# Altium project Geiger.PrjPcb
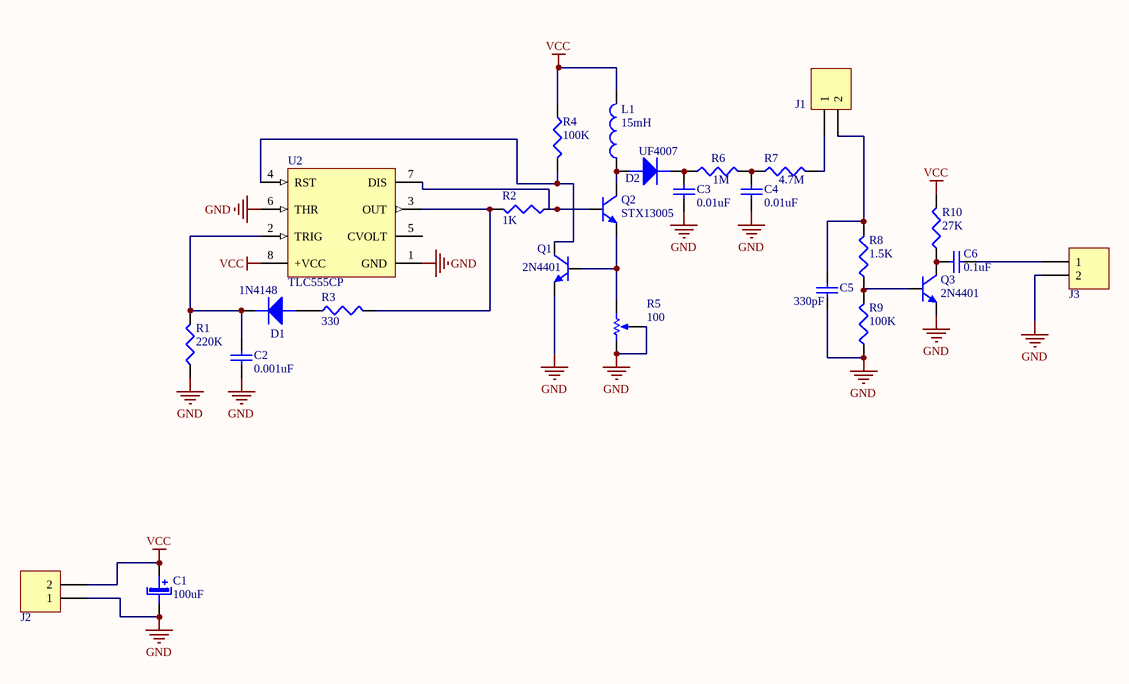
[diagram p0: Geiger.SchDoc]
1 sheet, 26 parts. Net scope: global (net labels, ports and power ports of the same name join across sheets).
Board file: Geiger.PcbDoc

## Sheet Geiger.SchDoc: Compteur Geiger
size A4; Author: Manoel da Silva; DrawnBy: Manoel da Silva; Engineer: Manoel da Silva

### Parts
C1  value 100uF  [CAPPR2-5x6.8]  (hidden comment: Cond pol axial)
C2  value 0.001uF  [CAPR2.54-5.1x3.2]  (hidden comment: Condensateur)
C3  value 0.01uF  [CAPPR5-5x5]  (hidden comment: Condensateur)
C4  value 0.01uF  [CAPPR5-5x5]  (hidden comment: Condensateur)
C5  value 330pF  [CAPR2.54-5.1x3.2]  (hidden comment: Condensateur)
C6  value 0.1uF  [CAPR2.54-5.1x3.2]  (hidden comment: Condensateur)
D1  value 1N4148  [AXIAL-0.3]  (hidden comment: Diode)
D2  Type: UF4007  [DIODE-0.4]  (hidden comment: Diode)
J1  Connecteur 2  [HDR1X2]  (value not drawn)
J2  Connecteur 2  [HDR1X2]  (value not drawn)
J3  Connecteur 2  [HDR1X2]  (value not drawn)
L1  value 15mH  [CAPPR7.5-16x35]  (hidden comment: Inductance)
Q1  value 2N4401  [TO-92]  (hidden comment: NPN)
Q2  value STX13005  [TO-92 - Bis]  (hidden comment: NPN)
Q3  value 2N4401  [TO-92]  (hidden comment: NPN)
R1  value 220K  [AXIAL-0.4]  (hidden comment: Résistance)
R2  value 1K  [AXIAL-0.4]  (hidden comment: Résistance)
R3  value 330  [AXIAL-0.4]  (hidden comment: Résistance)
R4  value 100K  [AXIAL-0.4]  (hidden comment: Résistance)
R5  Set Position: 100  [VR5]  (hidden comment: Potentiomètre)
R6  value 1M  [AXIAL-0.4]  (hidden comment: Résistance)
R7  value 4.7M  [AXIAL-0.4]  (hidden comment: Résistance)
R8  value 1.5K  [AXIAL-0.4]  (hidden comment: Résistance)
R9  value 100K  [AXIAL-0.4]  (hidden comment: Résistance)
R10  value 27K  [AXIAL-0.4]  (hidden comment: Résistance)
U2  TLC555CP  [DIP8]

### Nets
GND: C1.2(-) C2.1 C3.2 C4.2 C5.2 J2.1 J3.2 Q1.1(E) Q3.1(E) R1.1 R5.1(TOP) R5.3(TAP) R9.1 U2.1(GND) U2.6(THR)
VCC: C1.1(+) J2.2 L1.2 R4.1 R10.2 U2.8(+VCC)
NetC2_2: C2.2 D1.2(K) R1.2 U2.2(TRIG)
NetC3_1: C3.1 D2.2(K) R6.1
NetC4_1: C4.1 R6.2 R7.1
NetC5_1: C5.1 J1.2 R8.2
NetC6_1: C6.1 Q3.3(C) R10.1
NetC6_2: C6.2 J3.1
NetD1_1: D1.1(A) R3.1
NetD2_1: D2.1(A) L1.1 Q2.3(C)
NetJ1_1: J1.1 R7.2
NetQ1_2: Q1.2(B) Q2.1(E) R5.2(BOT)
NetQ1_3: Q1.3(C) R4.2 U2.4(RST)
NetQ2_2: Q2.2(B) R2.1 U2.7(DIS)
NetQ3_2: Q3.2(B) R8.1 R9.2
NetR2_2: R2.2 R3.2 U2.3(OUT)

Not connected (* = marked no-connect by the designer): U2 5(CVOLT)

### Library data of the parts
C1 = Cond pol axial: Condensateur polarisé; Type: Condensateur polarisé couché; Designer: ECAM 2004
D1 = Diode: Type: Diode standard; Designer: ECAM 2003
J1-J3 = Connecteur 2: Connecteur; Designer: ECAM 2005; Type: Connecteur à vis
Q1-Q3 = NPN: Transistor Bipolaire; Type: Transistor Bipolaire NPN; Designer: ECAM 2002
R1-R4 R6-R10 = Résistance: Résistance standard; Designer: ECAM 2005; Type: Résistance standard
U2 = LM555CN: Timer, 8-pin MDIP; Manufacturer: National Semiconductor; PackageTopMarking: NSUZXYTTE#*LM*555CN; PowerWise: N; CompType: Analog IC; Published: 4-Dec-2008; DatasheetVersion: Jul-2006; PackageVersion: revG, May-2006; PackageReference: N08E; Publisher: Altium Limited; PackageDescription: MDIP, .365 x .250 x .130in, 8 Lead, .100in Pitch; Supplier 1: Farnell; Supplier Part Number 1: 9488235; PartNumber: LM555CN; RoHS: N; PinCount: 8; Code_JEDEC: MS-001-BA; ComponentLink1Description: LM555 Datasheet; ComponentLink1URL: http://www.national.com/ds/LM/LM555.pdf; ComponentLink2Description: LM555 Web Page; ComponentLink2URL: http://www.national.com/pf/LM/LM555.html; ComponentLink3Description: N08E Package Page; ComponentLink3URL: http://www.national.com/packaging/folders/n08e.html
C2-C6 = Condensateur: Supplier: Farnell; Designer: ECAM 2004
D2 = Diode: Designer: ECAM 2003
L1 = Inductance: Designer: ECAM 2003
R5 = Potentiomètre: Designer: ECAM 2002; Type: Résistance variable